# EAGLE design 01_2019 - PLACA LEDS V1 (EAGLE 9.6.2)
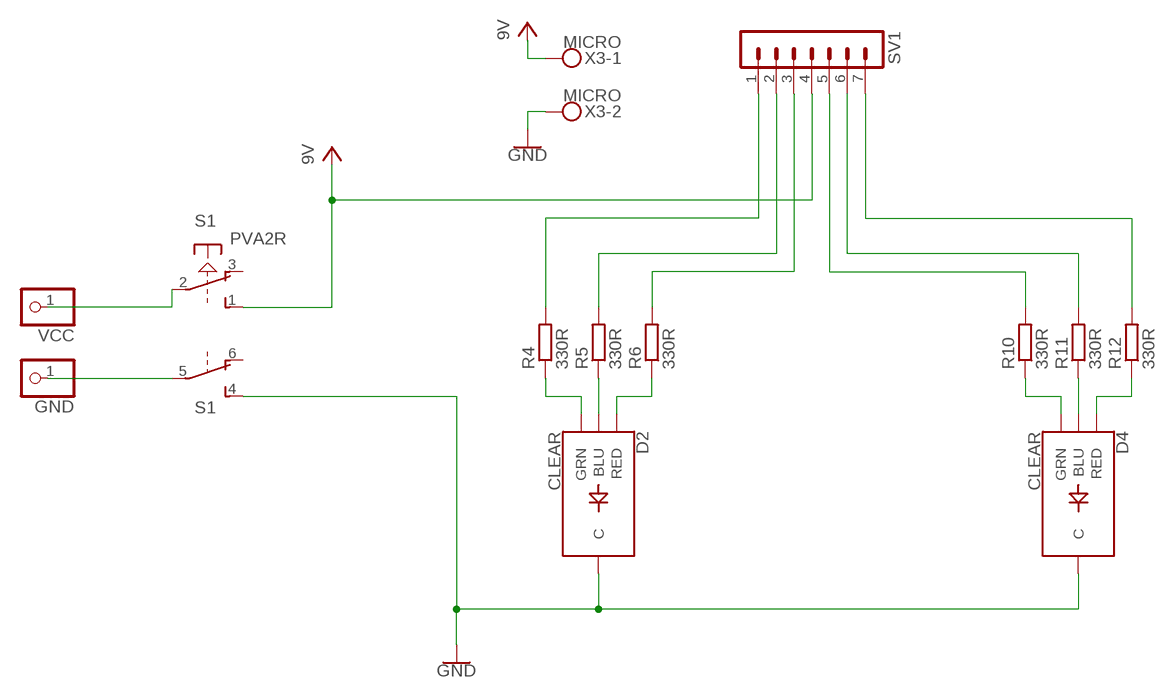
[diagram p0: schematic, sheet 1]

## Parts
D2  CLEAR  LED-RGB-CCCLEAR  [LED-RGB-THRU]
D4  CLEAR  LED-RGB-CCCLEAR  [LED-RGB-THRU]
GND  PINHD-1X1  [1X01]
R4  330R  R-EU_0204/7  [0204/7]
R5  330R  R-EU_0204/7  [0204/7]
R6  330R  R-EU_0204/7  [0204/7]
R10  330R  R-EU_0204/7  [0204/7]
R11  330R  R-EU_0204/7  [0204/7]
R12  330R  R-EU_0204/7  [0204/7]
S1  PVA2R  [PVA2R]
SV1  MA07-1  [MA07-1]
VCC  PINHD-1X1  [1X01]
X3  MICRO  MKDSN1,5/2-5,08  [MKDSN1,5/2-5,08]

## Nets
GND: D2.2(C) D4.2(C) S1.4(2:S) X3.2
N$1: R12.2 SV1.7
N$3: S1.2(1:P) VCC.1
N$4: D2.3(GRN) R4.1
N$5: D2.4(BLU) R5.1
N$6: D2.1(RED) R6.1
N$7: GND.1 S1.5(2:P)
N$31: R6.2 SV1.3
N$36: R5.2 SV1.2
N$37: R4.2 SV1.1
N$40: D4.3(GRN) R10.1
N$41: D4.4(BLU) R11.1
N$42: D4.1(RED) R12.1
N$43: R10.2 SV1.5
N$44: R11.2 SV1.6
VCC: S1.1(1:S) SV1.4 X3.1 ; supply symbol labelled 9V
Unconnected: S1.3(1:O) S1.6(2:O)

## Library data of the parts
D2 D4 = LED_RGB_CC:LED-RGB-CC: LED-RGB Common Cathode Packages: LED RGB-THRU LED_PIRANHA_5MM SparkFun Products: RGB Diffused Common Cathode- Diffuse <[https://www.sparkfun.com/products/9264]> RGB Diffused Common Cathode - Clear <[https://www.sparkfun.com/products/105]> LED-RGB 5mm Square (Piranha) <[https://www.sparkfun.com/products/11679]>; PROD_ID: DIO-08418
GND VCC = pinhead:PINHD-1X1: PIN HEADER
R4-R6 R10-R12 = resistor:R-EU_: RESISTOR, European symbol
S1 = switch-misc:PVA2R: ITT SWITCH
SV1 = con-lstb:MA07-1: PIN HEADER; OC_FARNELL: unknown; OC_NEWARK: unknown
X3 = con-phoenix-508:MKDSN1,5/2-5,08: MKDSN 1,5/ 2-5,08 Printklemme Nennstrom: 13,5 A Nennspannung: 250 V Rastermaß: 5,08 mm Polzahl: 2 Anschlussart: Schraubanschluss Montage: Löten Anschlussrichtung Leiter/Platine: 0 ° Artikelnummer: 1729128 Source: http://eshop.phoenixcontact.com .. 1729128.pdf

## Board
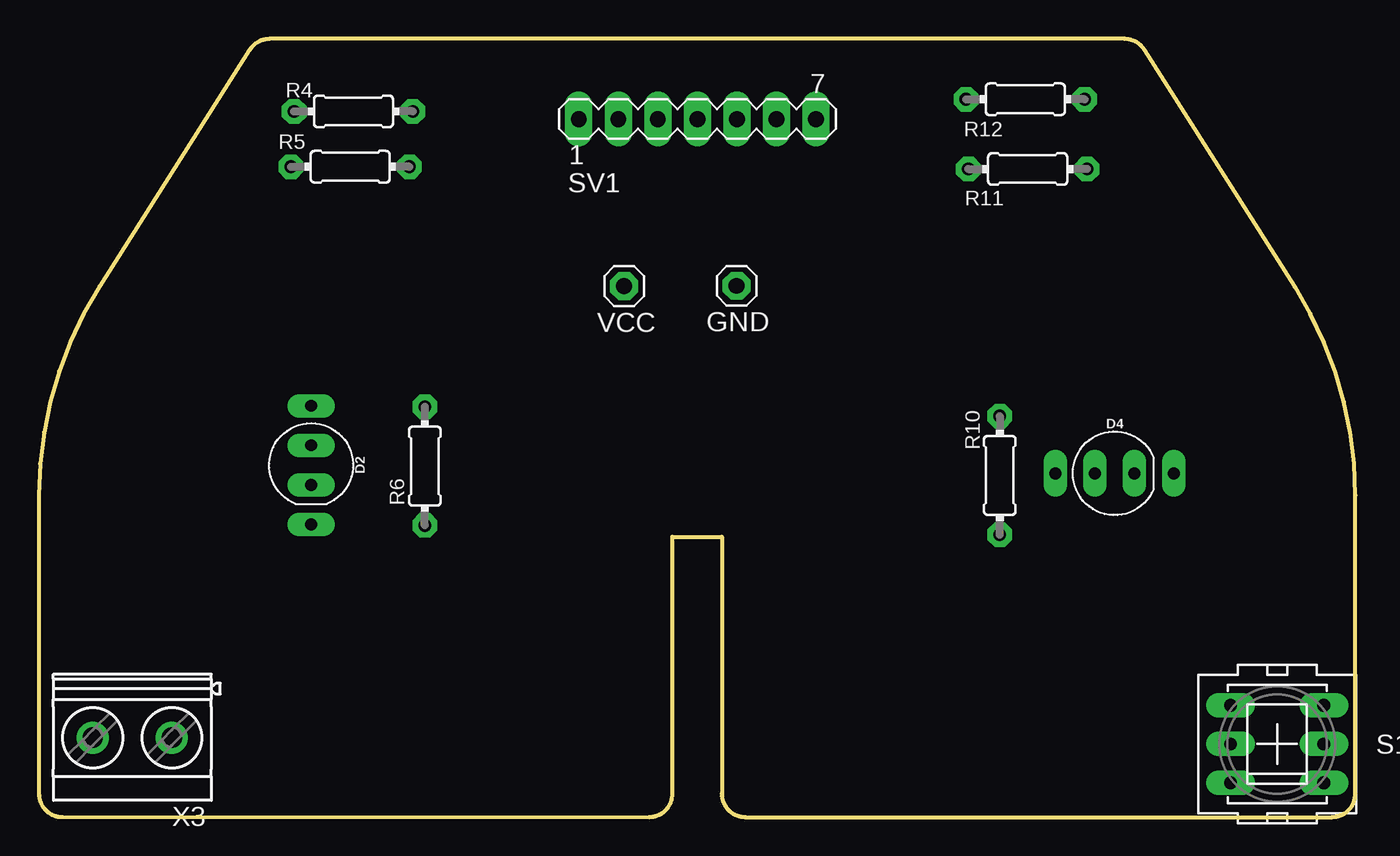
[diagram p1: board, top side]
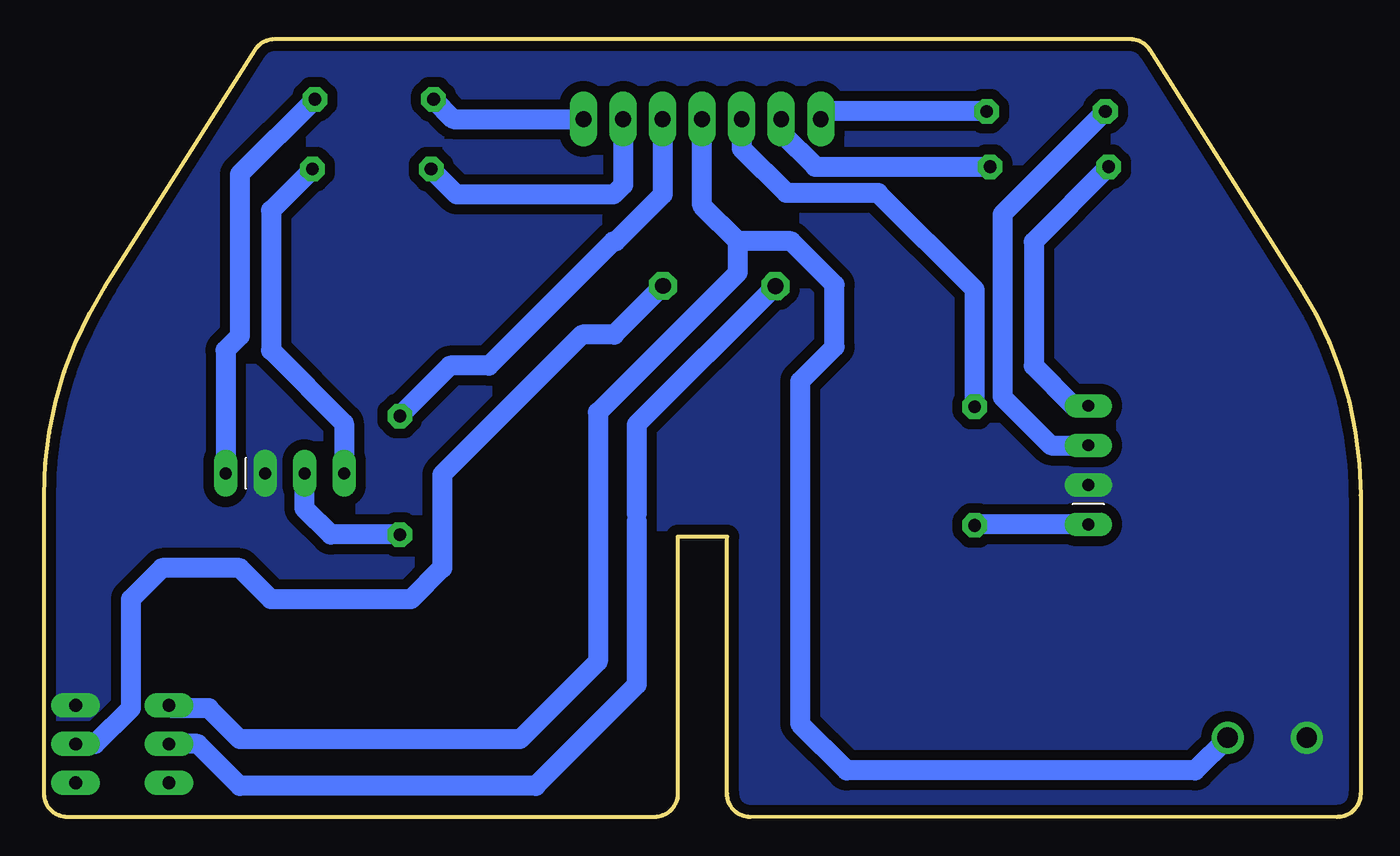
[diagram p2: board, bottom side, seen from below]

Size 84.57 x 50 mm. Coordinates in mm from the lower left corner, seen from the top.
Outline: 40.7,18 43.87,18 43.87,1.5 arc90 45.37,0 83.07,0 arc90 84.57,1.5 84.57,20.69 arc32 80.68,34.09 71.02,49.3 arc58 69.75,50 14.82,50 arc58 13.55,49.31 3.89,34.09 arc32 0,20.7 0,1.5 arc90 1.5,0.01 39.2,0 arc90 40.7,1.5 40.7,18
Copper layers (1*16): Top 0.035mm / dielectric 1.5mm / Bottom 0.035mm
Design rules "default *": minimum track width 40mil, minimum drill 0.35mm, track to track 10mil, track to pad 10mil, pad to pad 10mil, via to via 10mil, smd to smd 6mil, copper to edge 6mil, drill to drill 6mil, minimum pad ring 15mil, minimum via ring 5mil, stop-mask expansion 4mil, vias tented up to drill 0mil, thermal gap 10mil

### Footprints (pad centres in the part's own frame; a part is rotated, then mirrored left to right if it is on the bottom)
LED-RGB-THRU = drill 0.762 pad 1.27 long: 1 3.81,0; 2 1.27,0; 3 -1.27,0; 4 -3.81,0
1X01 = drill 1.016 octagon: 1 0,0
0204/7 = drill 0.813 octagon: 1 -3.81,0; 2 3.81,0
PVA2R = drill 0.813 long: 1 -2.997,2.489; 2 -2.997,0; 3 -2.997,-2.489; 4 2.997,2.489; 5 2.997,0; 6 2.997,-2.489
MA07-1 = drill 1.016 long: 1 -7.62,0; 2 -5.08,0; 3 -2.54,0; 4 0,0; 5 2.54,0; 6 5.08,0; 7 7.62,0
MKDSN1,5/2-5,08 = drill 1.3 pad 2: 1 -2.561,0.025; 2 2.519,0.025

### Placement (x,y rotation side)
D2  17.49,22.62 270 top
D4  69.11,22.09 0 top
GND  44.82,34.14 0 top
R4  20.21,45.35 0 top
R5  20,41.79 0 top
R6  24.79,22.55 90 top
R10  61.73,21.96 90 top
R11  63.52,41.64 180 top
R12  63.37,46.13 180 top
S1  79.55,4.69 0 top
SV1  42.3,44.86 0 top
VCC  37.59,34.12 0 top
X3  5.98,5.13 180 top

### Tracks (layer width: path | path; a pad name or v marks a point on that pad's centre or on a via)
GND
  pour Bottom (isolate 0.65, no thermals): -0.23,56.2 85.36,56.06 86.41,-0.77 0.21,-0.42
N$1
  Bottom 1.27: R12.2 58.29,44.86 SV1.7
N$3
  Bottom 1.016: 46.5,19.5 46.5,19
  Bottom 1.27: S1.2 74.69,4.69 72,2 53,2 46.5,8.5 46.5,19 | VCC.1 46.5,25.21 46.5,19.5
N$4
  Bottom 1.27: D2.3 19.89,23.89 23,27 23,38.74 R4.1
N$5
  Bottom 1.27: R5.1 21,36.98 21,29 18.43,26.43 D2.4
N$6
  Bottom 1.27: R6.1 24.73,18.81 D2.1
N$7
  Bottom 1.27: S1.5 81.31,4.69 79,7 79,14 77,16 72,16 70,14 61,14 59,16 59,22 50,31 47.96,31 GND.1
N$31
  Bottom 1.27: R6.2 24.79,33.89 31,40.1 36.9,40.1 39.76,42.97 SV1.3
N$36
  Bottom 1.27: SV1.2 37.22,43.99 35.02,41.79 R5.2
N$37
  Bottom 1.27: R4.2 34.19,45.35 SV1.1
N$40
  Bottom 1.27: R10.1 66.15,18.15 67.84,19.84 D4.3
N$41
  Bottom 1.27: R11.1 70,38.97 70,30 65.3,25.3 D4.4
N$42
  Bottom 1.016: 73,22.17 D4.1
  Bottom 1.27: D4.1 72.92,30 72,30.92 72,41.3 R12.1
N$43
  Bottom 1.27: SV1.5 44.84,40 47.84,37 48,37 56,29 58.5,29 R10.2
N$44
  Bottom 1.27: SV1.6 47.38,40.62 48,40 58.07,40 R11.2
VCC
  Bottom 1.27: S1.1 76.37,7 74,7 72,5 54,5 49,10 49,26 40,35 40,37 | X3.1 10.64,3 33,3 36,6 36,28 33.8,30.2 33.8,34.2 36.59,37 40,37 | 40,37 42.3,39.3 SV1.4